# EAGLE design Sche1 (EAGLE 7.2.0)
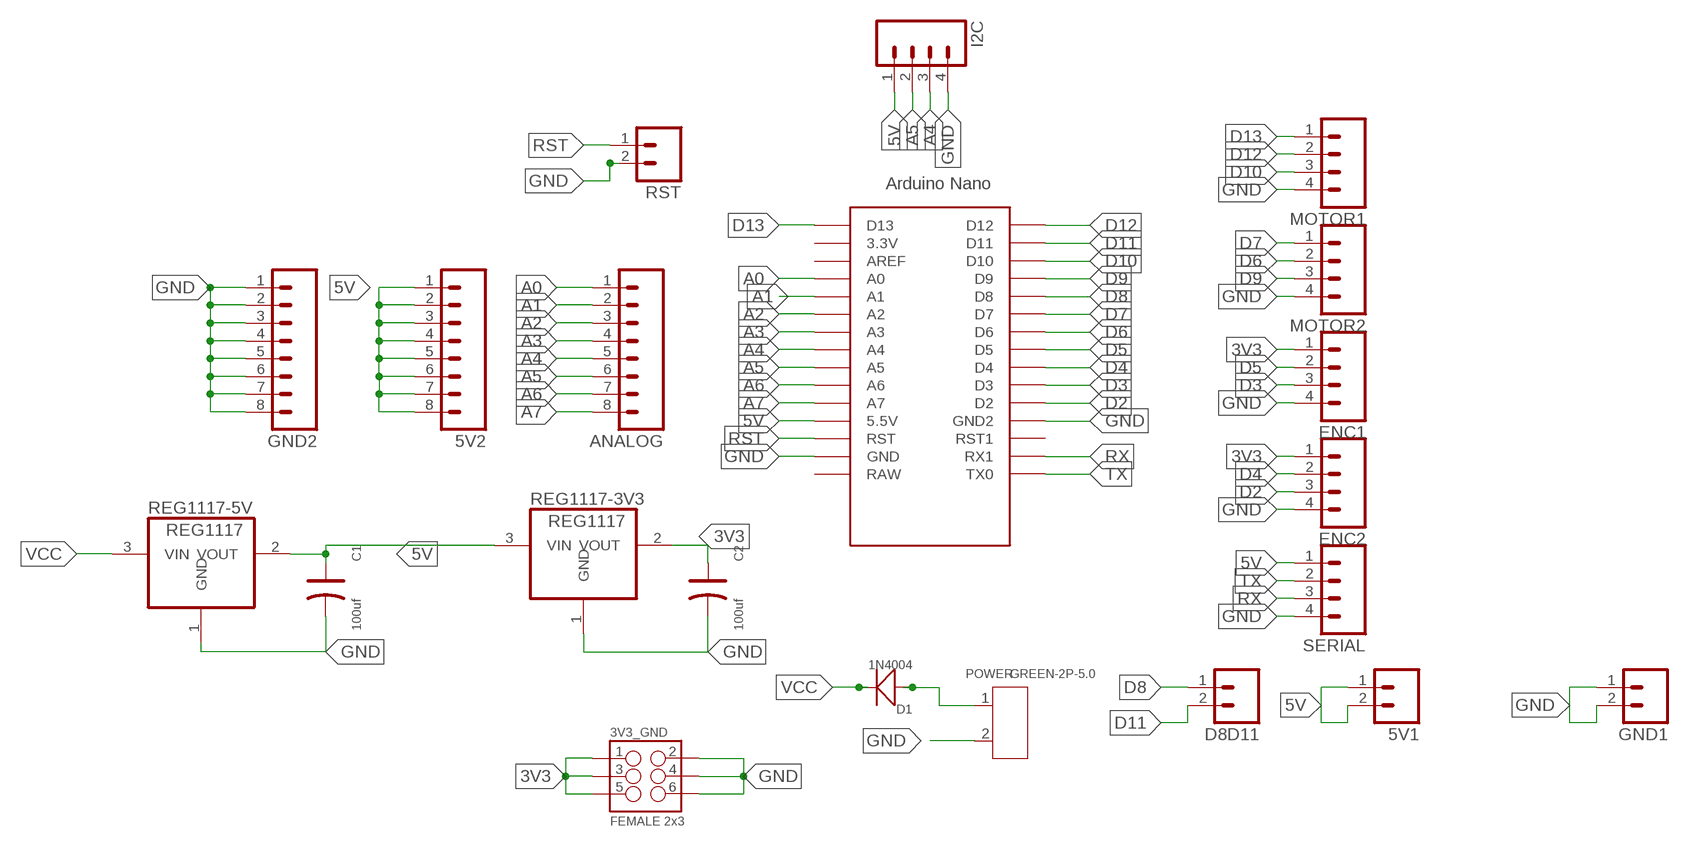
[diagram p0: schematic, sheet 1]

## Parts
3V3_GND  FEMALE 2x3  M03X2FEMALE  [2X3]
5V1  M02PTH  [1X02]
5V2  M08SILK_FEMALE_PTH  [1X08]
ANALOG  M08SILK_FEMALE_PTH  [1X08]
C1  100uf  DIP-ALUMINUM-100UF-16V(D5-H7MM)  [PC-D5.3MM]
C2  100uf  DIP-ALUMINUM-100UF-16V(D5-H7MM)  [PC-D5.3MM]
D1  1N4004  DIP-DIODE-400V-1A(DO-41)  [DO-41]
D8D11  M02PTH  [1X02]
ENC1  M04PTH  [1X04]
ENC2  M04PTH  [1X04]
GND1  M02PTH  [1X02]
GND2  M08SILK_FEMALE_PTH  [1X08]
I2C  M04PTH  [1X04]
MOTOR1  M04PTH  [1X04]
MOTOR2  M04PTH  [1X04]
POWER  GREEN-2P-5.0  SCREW-TERMINAL-GREEN(2P-5.0)  [H2-5.0-10.5X8.0MM]
REG1117-3V3  REG1117  [SOT223]
REG1117-5V  REG1117  [SOT223]
RST  M02PTH  [1X02]
SERIAL  M04PTH  [1X04]
U$1  NANO  [NANO]

## Nets
3V3: 3V3_GND.1 3V3_GND.3 3V3_GND.5 C2.+ ENC1.1 ENC2.1 REG1117-3V3.2(VOUT)
5V: 5V1.1 5V1.2 5V2.1 5V2.2 5V2.3 5V2.4 5V2.5 5V2.6 5V2.7 5V2.8 C1.+ I2C.1 REG1117-3V3.3(VIN) REG1117-5V.2(VOUT) SERIAL.1 U$1.5V(5.5V)
A0: ANALOG.1 U$1.A0
A1: ANALOG.2 U$1.A1
A2: ANALOG.3 U$1.A2
A3: ANALOG.4 U$1.A3
A4: ANALOG.5 I2C.3 U$1.A4
A5: ANALOG.6 I2C.2 U$1.A5
A6: ANALOG.7 U$1.A6
A7: ANALOG.8 U$1.A7
D2: ENC2.3 U$1.D2
D3: ENC1.3 U$1.D3
D4: ENC2.2 U$1.D4
D5: ENC1.2 U$1.D5
D6: MOTOR2.2 U$1.D6
D7: MOTOR2.1 U$1.D7
D8: D8D11.1 U$1.D8
D9: MOTOR2.3 U$1.D9
D10: MOTOR1.3 U$1.D10
D11: D8D11.2 U$1.D11
D12: MOTOR1.2 U$1.D12
D13: MOTOR1.1 U$1.D13
GND: 3V3_GND.2 3V3_GND.4 3V3_GND.6 C1.- C2.- ENC1.4 ENC2.4 GND1.1 GND1.2 GND2.1 GND2.2 GND2.3 GND2.4 GND2.5 GND2.6 GND2.7 GND2.8 I2C.4 MOTOR1.4 MOTOR2.4 POWER.2 REG1117-3V3.1(GND) REG1117-5V.1(GND) RST.2 SERIAL.4 U$1.GND U$1.GND1(GND2)
N$1: D1.1(+) POWER.1
RST: RST.1 U$1.RST
RX: SERIAL.3 U$1.RX1
TX: SERIAL.2 U$1.TX0
VCC: D1.2(-) REG1117-5V.3(VIN)
Unconnected: U$1.3.3V U$1.AREF U$1.RAW U$1.RST1

## Library data of the parts
3V3_GND = SparkFun-Connectors:M03X2: 2x3 .1" header. Shrouded, with keying- CONN-10681 SMT- CONN-11415 Pogo pins- HW-11044; PROD_ID: CONN-11566
5V1 D8D11 GND1 RST = SparkFun-Connectors:M02: Standard 2-pin 0.1" header. Use with - straight break away headers ( PRT-00116) - right angle break away headers (PRT-00553) - swiss pins (PRT-00743) - machine pins (PRT-00117) - female headers (PRT-00115) Molex polarized connector foot print use with: PRT-08233 with associated crimp pins and housings. 2.54_SCREWTERM for use with PRT-10571. 3.5mm Screw Terminal footprints for PRT-08084 5mm Screw Terminal footprints for use with PRT-08432
5V2 ANALOG GND2 = SparkFun-Connectors:M08: Header 8 Standard 8-pin 0.1" header. Use with straight break away headers (SKU : PRT-00116), right angle break away headers (PRT-00553), swiss pins (PRT-00743), machine pins (PRT-00117), and female headers (PRT-00115).; PROD_ID: CONN-08438
C1 C2 = Seeed-Capacitor-2016:DIP-ALUMINUM-100UF-16V(D5-H7MM): 302030031; MPN: KS 100uF/16V
D1 = Seeed-Diode-2016:DIP-DIODE-400V-1A(DO-41): 304010008; MPN: 1N4004
ENC1 ENC2 I2C MOTOR1 MOTOR2 SERIAL = SparkFun-Connectors:M04: Header 4 Standard 4-pin 0.1" header. Use with straight break away headers (SKU : PRT-00116), right angle break away headers (PRT-00553), swiss pins (PRT-00743), machine pins (PRT-00117), and female headers (PRT-00115). Molex polarized connector foot print use with SKU : PRT-08231 with associated crimp pins and housings. 1MM SMD Version SKU: PRT-10208; PROD_ID: CONN-09696
POWER = Seeed-Connector -2016:SCREW-TERMINAL-GREEN(2P-5.0): 320110031
REG1117-3V3 REG1117-5V = burr-brown:REG1117: 800mA and 1A Low Dropout (LDO) Positive Regulator 1.8V, 2.5V, 2.85V, 3.3V, 5V, and Adj; MPN: REG1117; OC_FARNELL: 1097566; OC_NEWARK: 14P6981
U$1 = Arduino-clone:NANO: Arduino Nano

## Board
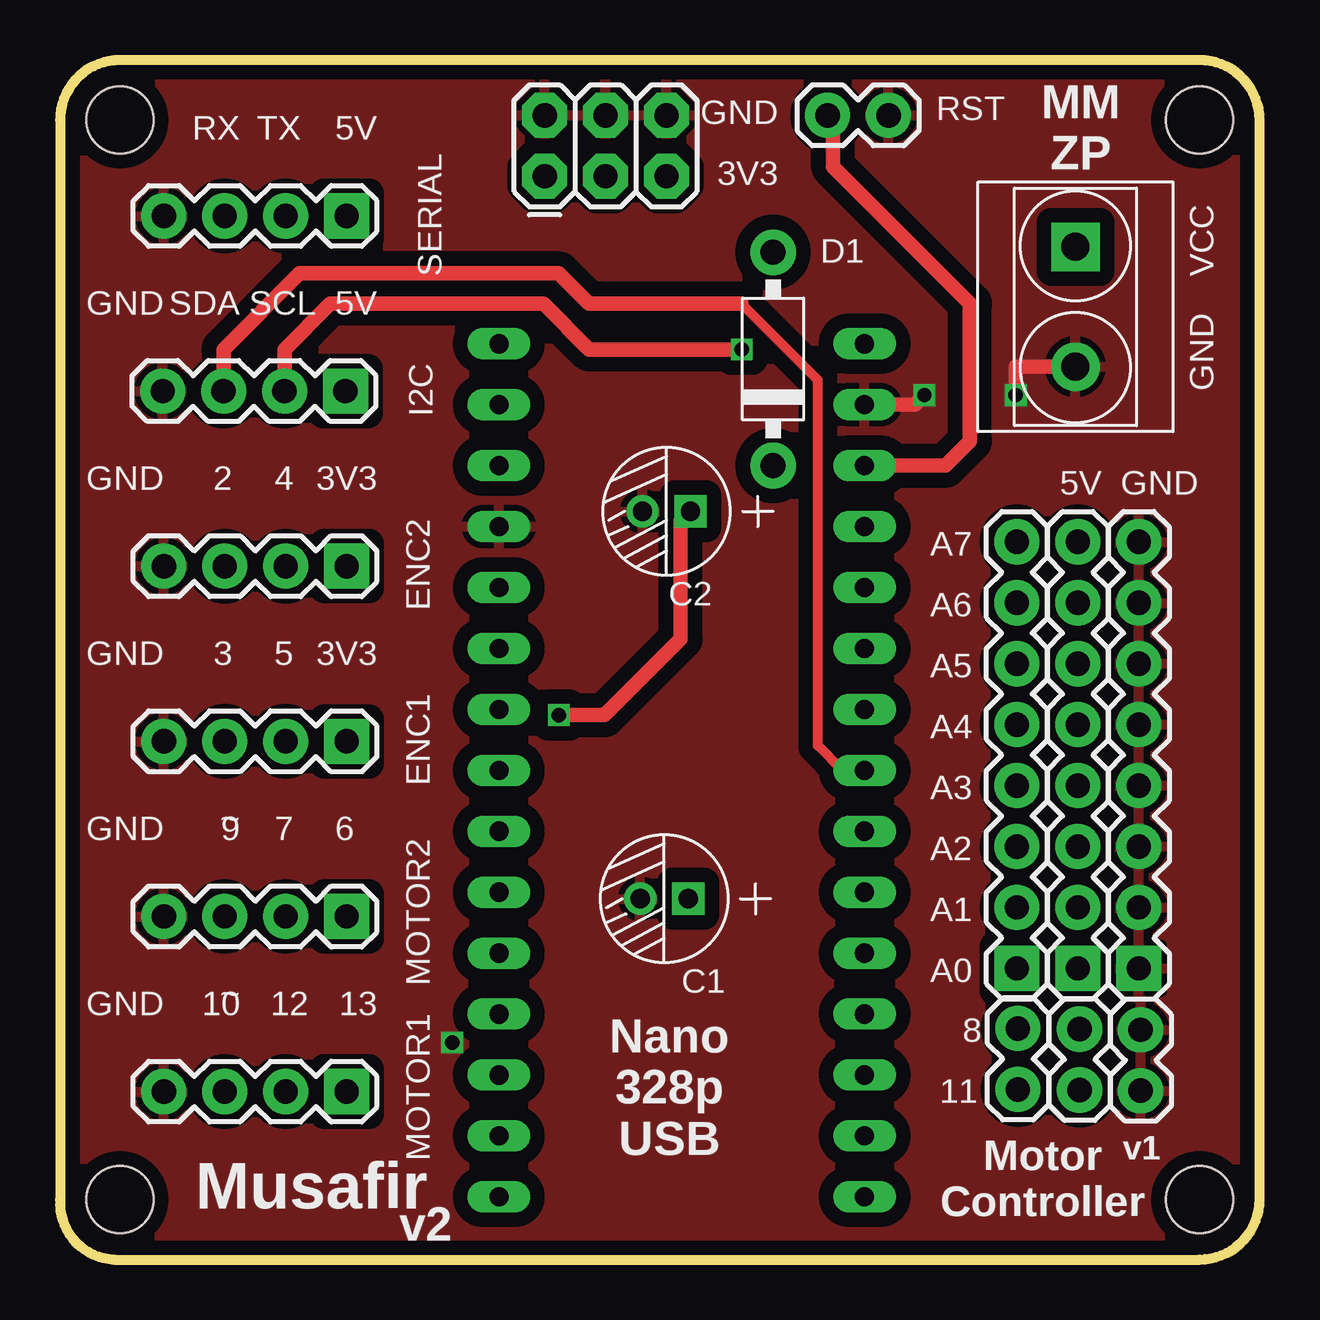
[diagram p1: board, top side]
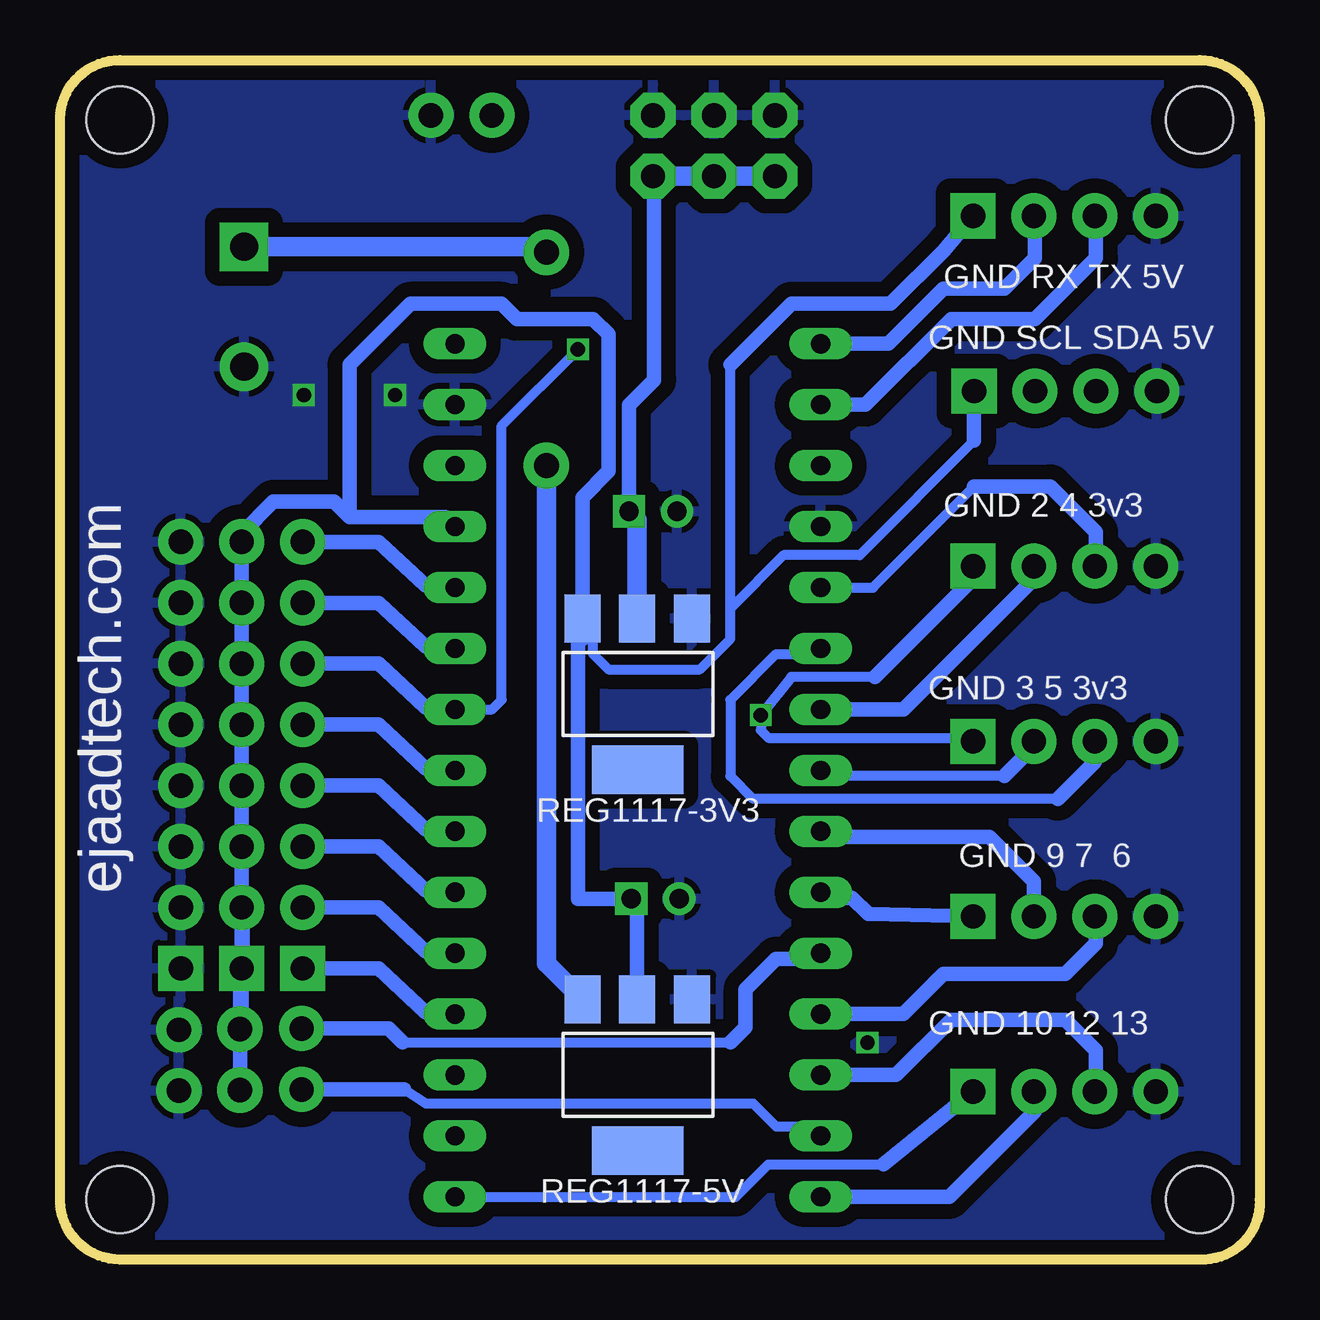
[diagram p2: board, bottom side, seen from below]

Size 50 x 50 mm. Coordinates in mm from the lower left corner, seen from the top.
Outline: 47.5,50 2.5,50 arc90 0,47.5 0,2.5 arc90 2.25,0 47.5,0 arc90 50,2.5 50,47.5 arc90 47.5,50
Copper layers (1*16): Top 0.035mm / dielectric 1.5mm / Bottom 0.035mm
Design rules "SeeedStudio_2layer_DRU_no_angle_20140221": minimum track width 6mil, minimum drill 12mil, track to track 6mil, track to pad 6mil, pad to pad 6mil, via to via 6mil, smd to smd 0mil, copper to edge 10mil, drill to drill 10mil, minimum pad ring 10mil, minimum via ring 6mil, stop-mask expansion 2mil, vias tented up to drill 100mil, thermal gap 10mil
Holes 2.8 mm at 2.5,2.5 47.5,2.5 2.5,47.5 47.5,47.5

### Footprints (pad centres in the part's own frame; a part is rotated, then mirrored left to right if it is on the bottom)
2X3 = drill 1.016 pad 1.88 octagon: 1 0,0; 2 0,2.54; 3 2.54,0; 4 2.54,2.54; 5 5.08,0; 6 5.08,2.54
1X02 = drill 1.016 pad 1.88: 1 0,0; 2 2.54,0
1X08 = drill 1.016 pad 1.88 square: 1 0,0 | drill 1.016 pad 1.88: 2 2.54,0; 3 5.08,0; 4 7.62,0; 5 10.16,0; 6 12.7,0; 7 15.24,0; 8 17.78,0
PC-D5.3MM = drill 0.8 pad 1.35 square: + -1,0 | drill 0.8 pad 1.35: - 1,0
DO-41 = drill 1.041 pad 1.905: 1 -4.445,0; 2 4.445,0
1X04 = drill 1.016 pad 1.88 square: 1 0,0 | drill 1.016 pad 1.88: 2 2.54,0; 3 5.08,0; 4 7.62,0
H2-5.0-10.5X8.0MM = drill 1.168 pad 2.032 square: 1 0,2.5 | drill 1.168 pad 2.032: 2 0,-2.5
SOT223 = smd 1.499 x 2.007: 1 -2.261,-3.15; 2 0.025,-3.15; 3 2.311,-3.15 | smd 3.81 x 2.007: 4 0,3.15
NANO = drill 0.8 long: 3.3V -10.16,24.13; 5V -10.16,-1.27; A0 -10.16,19.05; A1 -10.16,16.51; A2 -10.16,13.97; A3 -10.16,11.43; A4 -10.16,8.89; A5 -10.16,6.35; A6 -10.16,3.81; A7 -10.16,1.27; AREF -10.16,21.59; D2 5.08,1.27; D3 5.08,3.81; D4 5.08,6.35; D5 5.08,8.89; D6 5.08,11.43; D7 5.08,13.97; D8 5.08,16.51; D9 5.08,19.05; D10 5.08,21.59; D11 5.08,24.13; D12 5.08,26.67; D13 -10.16,26.67; GND -10.16,-6.35; GND1 5.08,-1.27; RAW -10.16,-8.89; RST -10.16,-3.81; RST1 5.08,-3.81; RX1 5.08,-6.35; TX0 5.08,-8.89

### Placement (x,y rotation side)
3V3_GND  20.2,45.16 0 top
5V1  42.5,9.6 270 top
5V2  42.43,12.13 90 top
ANALOG  39.89,12.13 90 top
C1  25.19,15.04 180 top
C2  25.28,31.18 180 top
D1  29.73,37.53 270 top
D8D11  39.93,9.63 270 top
ENC1  11.95,21.6 180 top
ENC2  11.95,28.9 180 top
GND1  45.04,9.57 270 top
GND2  44.97,12.13 90 top
I2C  11.9,36.2 180 top
MOTOR1  11.95,7 180 top
MOTOR2  11.95,14.3 180 top
POWER  42.33,39.71 0 top
REG1117-3V3  25.92,23.57 180 bottom
REG1117-5V  25.92,7.69 180 bottom
RST  32,47.7 0 top
SERIAL  11.95,43.5 180 top
U$1  23.38,29.28 180 top

### Tracks (layer width: path | path; a pad name or v marks a point on that pad's centre or on a via)
3V3  (via drill 0.6)
  Top 0.406: 25.87,30.77 C2.+
  Top 0.61: v20.79,22.7 22.7,22.7 25.87,25.87 25.87,30.77
  Bottom 0.406: 16.03,24.28 19.52,24.28 v20.79,22.7 20.79,22.06 20.47,21.74 12.18,21.74
  Bottom 0.61: ENC2.1 11.95,28.36 16.03,24.28 | 12.18,21.74 ENC1.1 | C2.+ 26.28,35.62 25.24,36.66 25.24,45.11 | 25.24,45.11 3V3_GND.5 | 25.24,45.11 22.74,45.11 3V3_GND.3
  Bottom 0.813: 3V3_GND.1 3V3_GND.3 3V3_GND.5 | REG1117-3V3.2 25.94,30.84 C2.+
5V
  Bottom 0.406: REG1117-3V3.3 27.78,26.9 27.78,25.23 27.14,24.6 23.33,24.6 22.06,25.87 22.06,27.14 | 11.9,34.13 16.66,29.36 19.84,29.36 22.06,27.14 | 22.06,27.14 22.06,37.3
  Bottom 0.61: 5V2.1 5V2.2 | SERIAL.1 13.17,42.02 15.39,39.84 19.52,39.84 22.06,37.3 | 5V2.1 42.5,12.13 5V1.1 | 5V1.1 5V1.2 | 37.94,30.95 38.57,31.59 41.11,31.59 42.43,30.27 5V2.8 5V2.7 5V2.6 5V2.5 5V2.4 5V2.3 5V2.2 | 37.94,30.95 33.94,30.95 U$1.5V | REG1117-5V.2 25.94,14.79 C1.+ 28.41,15.04 28.41,25.87 28.23,25.87 REG1117-3V3.3 28.23,31.77 27.14,32.85 27.14,38.57 27.78,39.2 30.95,39.2 31.59,39.84 35.4,39.84 37.94,37.3 37.94,30.95 | I2C.1 11.9,34.13 | 5V2.2 42.38,14.68 42.38,11.9 | 5V1.1 42.43,9.6 5V2.1
A0
  Bottom 0.61: U$1.A0 34.76,10.31 36.71,12.13 ANALOG.1
A1
  Bottom 0.61: U$1.A1 34.76,12.85 36.71,14.68 ANALOG.2
A2
  Bottom 0.61: U$1.A2 34.76,15.39 36.71,17.21 ANALOG.3
A3
  Bottom 0.61: U$1.A3 34.76,17.93 36.71,19.75 ANALOG.4
A4
  Top 0.406: U$1.A4 32.62,20.39 31.59,21.43 31.59,36.66 28.41,39.84 | 6.82,36 I2C.3
  Top 0.61: 28.41,39.84 22.06,39.84 20.79,41.11 10,41.11 6.82,37.94 6.82,36
  Bottom 0.61: U$1.A4 34.76,20.47 36.71,22.3 ANALOG.5
A5  (via drill 0.6)
  Top 0.406: 9.36,36 I2C.2
  Top 0.61: v28.41,37.94 22.06,37.94 20.16,39.84 11.27,39.84 9.36,37.94 9.36,36
  Bottom 0.406: U$1.A5 31.99,22.93 31.59,23.33 31.59,34.76 v28.41,37.94
  Bottom 0.61: U$1.A5 34.76,23.01 36.71,24.84 ANALOG.6
A6
  Bottom 0.61: U$1.A6 34.76,25.55 36.71,27.38 ANALOG.7
A7
  Bottom 0.61: U$1.A7 34.76,28.09 36.71,29.91 ANALOG.8
D2
  Bottom 0.406: U$1.D2 16.11,28.01 11.9,32.22 | 6.82,29.32 ENC2.3
  Bottom 0.61: 11.9,32.22 8.73,32.22 6.82,30.32 6.82,29.32
D3
  Bottom 0.406: 8.41,19.2 21.11,19.2 22.06,20.16 22.06,23.33 20.16,25.23 18.53,25.23 U$1.D3
  Bottom 0.61: ENC1.3 6.87,20.75 8.41,19.2
D4
  Bottom 0.406: 9.36,29.23 ENC2.2
  Bottom 0.61: U$1.D4 14.84,22.93 9.36,28.41 9.36,29.23
D5
  Bottom 0.406: 10.63,20.16 18.06,20.16 U$1.D5
  Bottom 0.61: ENC1.2 9.41,21.38 10.63,20.16
D6
  Bottom 0.61: MOTOR2.2 9.41,15.76 11.27,17.61 18.06,17.61 U$1.D6
D7
  Bottom 0.61: MOTOR2.1 16.31,14.4 16.98,15.07 18.06,15.07 U$1.D7
D8
  Bottom 0.406: 35.71,9.04 22.06,9.04
  Bottom 0.61: D8D11.1 36.3,9.63 35.71,9.04 | 22.06,9.04 21.43,9.68 21.43,11.27 20.16,12.54 19.17,12.54 U$1.D8
D9
  Bottom 0.61: U$1.D9 14.85,10.23 13.17,11.9 8.09,11.9 6.82,13.17 MOTOR2.3
D10
  Bottom 0.406: 6.82,7.74 MOTOR1.3
  Bottom 0.61: U$1.D10 15.16,7.69 12.85,9.99 8.09,9.99 6.82,8.72 6.82,7.74
D11
  Bottom 0.406: 35.66,7.09 34.76,6.5 21.11,6.5 20.16,5.55 18.7,5.55 U$1.D11
  Bottom 0.61: D8D11.2 35.66,7.09
D12
  Bottom 0.406: 9.36,7.64 MOTOR1.2
  Bottom 0.61: U$1.D12 12.94,2.61 9.36,6.18 9.36,7.64
D13
  Bottom 0.406: U$1.D13 21.83,2.61 20.47,3.96 15.67,3.96
  Bottom 0.61: 15.67,3.96 MOTOR1.1
GND  (via drill 0.6)
  Top 0.61: POWER.2 39.84,37.21 v39.84,36.03 | v36.03,36.03 35.63,35.63 U$1.GND
  other vias: 16.35,9.04
  pour Bottom (isolate 0.61): 50,50 0,50 0,0 50,0
  pour Top (isolate 0.61): 0,50 50,50 50,0 0,0
N$1
  Bottom 0.813: POWER.1 29.96,42.21 D1.1
RST
  Top 0.61: U$1.RST 36.9,33.09 37.94,34.12 37.94,39.84 32.22,45.55 32.22,47.47 RST.1
RX
  Bottom 0.406: 6.82,43.2 SERIAL.3
  Bottom 0.61: U$1.RX1 16.43,35.63 12.85,39.2 9.36,39.2 6.82,41.74 6.82,43.2
TX
  Bottom 0.406: 9.36,43.2 SERIAL.2
  Bottom 0.61: U$1.TX0 15.48,38.17 13.17,40.48 10.63,40.48 9.36,41.74 9.36,43.2
VCC
  Bottom 0.813: D1.2 29.73,12.34 REG1117-5V.3

### Text on the board
tNames: RX | TX | 5V | GND | MM / ZP | 3V3 | VCC | GND | SDA | SCL | 5V | GND | GND | 2 | 4 | 3V3 | 5V | GND | A7 | A6 | GND | 3 | 5 | 3V3 | A5 | A4 | ~ | A3 | GND | 9 | 7 | 6 | A2 | A1 | ~ | A0 | GND | 10 | 12 | 13 | 8 | Nano / 328p / USB | 11 | v1 | Musafir | Motor / Controller | v2
bNames: GND RX TX 5V | GND SCL SDA 5V | ejaadtech.com | GND 2 4 3v3 | GND 3 5 3v3 | GND 9 7 6 | GND 10 12 13